# Altium schematic sheet USBCONN_A_short.SchDoc
size A3; SheetNumber: 16; SheetTotal: 22
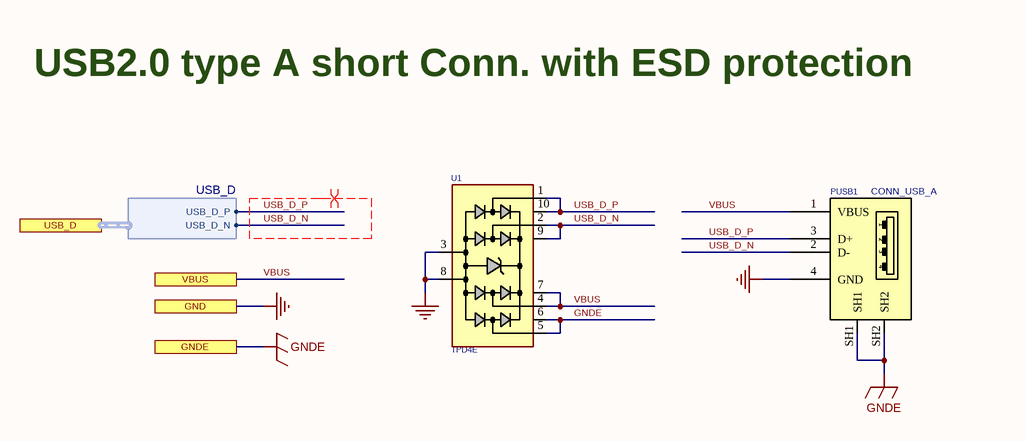
[diagram p0: USBCONN_A_short.SchDoc]

## Parts
PUSB1  CONN_USB_A  [USB_A_REC_RA_THD_S]
U1  TPD4E  [SON50_10_2510]

## Ports
GND, GNDE, USB_D (harness USB_D), VBUS

## Harnesses
USB_D: USB_D_P, USB_D_N

## Nets
GND: PUSB1.4(GND) U1.3 U1.8 ; port GND
GNDE: PUSB1.SH1 PUSB1.SH2 U1.5 U1.6 ; port GNDE
USB_D_N: PUSB1.2(D-) U1.2 U1.9 ; port USB_D.USB_D_N
USB_D_P: PUSB1.3(D+) U1.1 U1.10 ; port USB_D.USB_D_P
VBUS: PUSB1.1(VBUS) U1.4 U1.7 ; port VBUS

## Layout directives
differential pair: USB_D_N, USB_D_P

## Notes on the sheet
- USB2.0 type A short Conn. with ESD protection

## Library data of the parts
PUSB1 = CONN_USB_A_REC_RA_THD_SHORT: CONN, USB, A, RECEPTACLE, R/A, THD; MANF_P#: USB1125; VALUE: CONN_USB_A
U1 = TVS_X4_TPD4E05U06: TVS, ESD PROTECT, 4CH,; MANF_P#: TPD4E05U06DQA; MANF: Texas Instruments; PARAM2: 6.5Vbr, 0.4pF, –40°~125°C; PARAM: ±12-kV ContactD, ±15-kVAirD; PRICE: 0.6$; VALUE: TPD4E